# EAGLE schematic 32a4u (EAGLE 6.1)
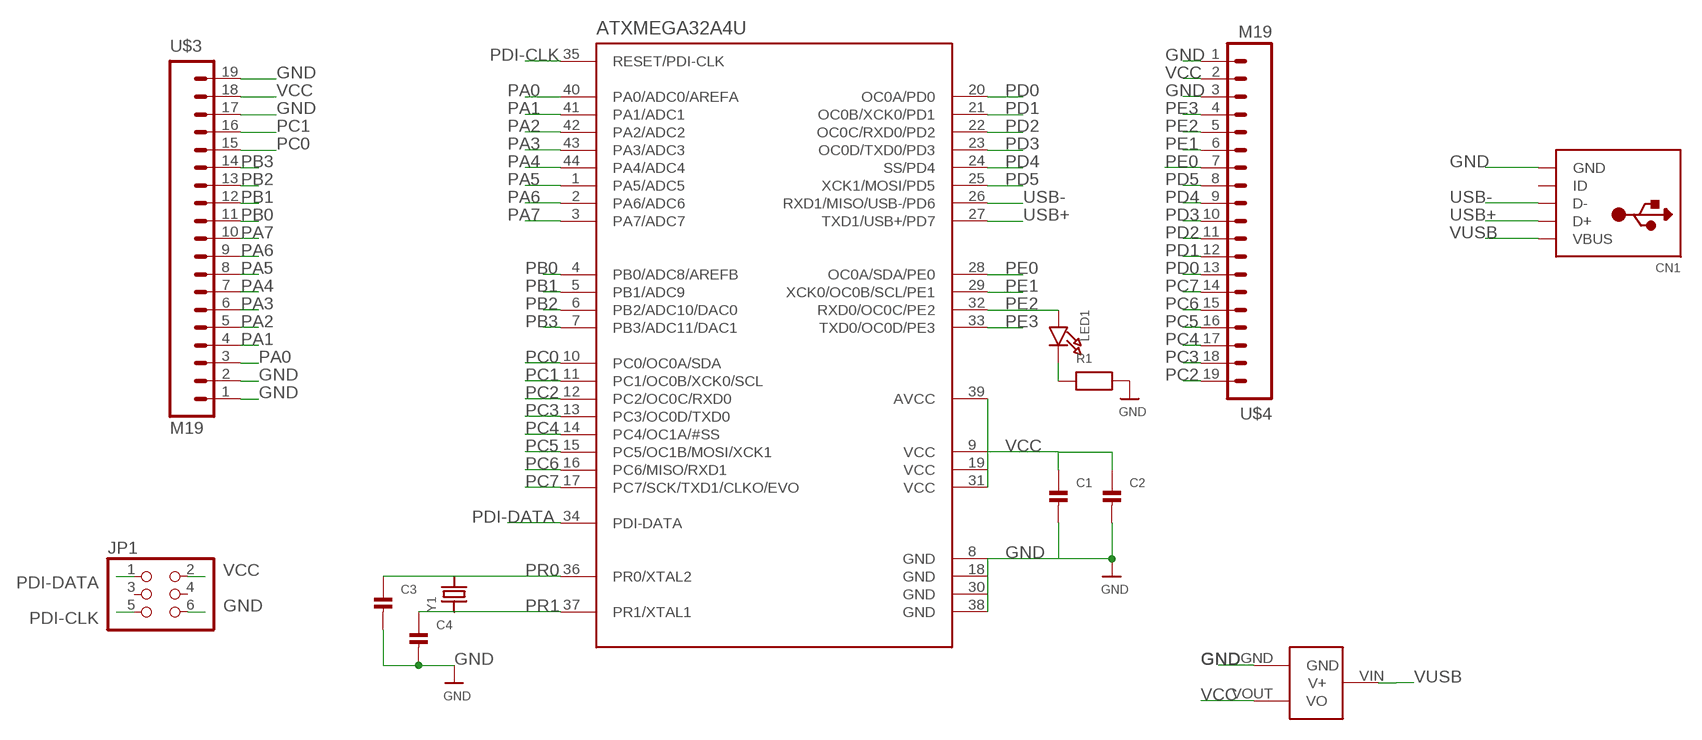
[diagram p0: schematic, sheet 1]

## Parts
ATXMEGA32A4U  ATXMEGAXXA4U-AU  [TQFP-44]
C1  CAP_CERAMIC0603  [0603]
C2  CAP_CERAMIC0603  [0603]
C3  CAP_CERAMIC0603  [0603]
C4  CAP_CERAMIC0603  [0603]
CN1  USBMICROB  [USB-MICROB]
JP1  HEADER-2X3  [2X03]
LED1  LED0603  [CHIPLED_0603]
R1  RESISTOR0603  [0603]
U$2  MCP1700  [SOT23-3]
U$3  M19  [1X19]
U$4  M19  [1X19]
Y1  CRYSTAL  [NX8045GB]

## Nets
GND: ATXMEGA32A4U.8(GND) ATXMEGA32A4U.18(GND) ATXMEGA32A4U.30(GND) ATXMEGA32A4U.38(GND) C1.2 C2.2 C3.2 C4.2 CN1.P5(GND) JP1.6 R1.2 U$2.GND U$3.1 U$3.2 U$3.17 U$3.19 U$4.1 U$4.3
N$1: LED1.C R1.1
PA0: ATXMEGA32A4U.40(PA0/ADC0/AREFA) U$3.3
PA1: ATXMEGA32A4U.41(PA1/ADC1) U$3.4
PA2: ATXMEGA32A4U.42(PA2/ADC2) U$3.5
PA3: ATXMEGA32A4U.43(PA3/ADC3) U$3.6
PA4: ATXMEGA32A4U.44(PA4/ADC4) U$3.7
PA5: ATXMEGA32A4U.1(PA5/ADC5) U$3.8
PA6: ATXMEGA32A4U.2(PA6/ADC6) U$3.9
PA7: ATXMEGA32A4U.3(PA7/ADC7) U$3.10
PB0: ATXMEGA32A4U.4(PB0/ADC8/AREFB) U$3.11
PB1: ATXMEGA32A4U.5(PB1/ADC9) U$3.12
PB2: ATXMEGA32A4U.6(PB2/ADC10/DAC0) U$3.13
PB3: ATXMEGA32A4U.7(PB3/ADC11/DAC1) U$3.14
PC0: ATXMEGA32A4U.10(PC0/OC0A/SDA) U$3.15
PC1: ATXMEGA32A4U.11(PC1/OC0B/XCK0/SCL) U$3.16
PC2: ATXMEGA32A4U.12(PC2/OC0C/RXD0) U$4.19
PC3: ATXMEGA32A4U.13(PC3/OC0D/TXD0) U$4.18
PC4: ATXMEGA32A4U.14(PC4/OC1A/#SS) U$4.17
PC5: ATXMEGA32A4U.15(PC5/OC1B/MOSI/XCK1) U$4.16
PC6: ATXMEGA32A4U.16(PC6/MISO/RXD1) U$4.15
PC7: ATXMEGA32A4U.17(PC7/SCK/TXD1/CLKO/EVO) U$4.14
PD0: ATXMEGA32A4U.20(OC0A/PD0) U$4.13
PD1: ATXMEGA32A4U.21(OC0B/XCK0/PD1) U$4.12
PD2: ATXMEGA32A4U.22(OC0C/RXD0/PD2) U$4.11
PD3: ATXMEGA32A4U.23(OC0D/TXD0/PD3) U$4.10
PD4: ATXMEGA32A4U.24(SS/PD4) U$4.9
PD5: ATXMEGA32A4U.25(XCK1/MOSI/PD5) U$4.8
PDI-CLK: ATXMEGA32A4U.35(RESET/PDI-CLK) JP1.5
PDI-DATA: ATXMEGA32A4U.34(PDI-DATA) JP1.1
PE0: ATXMEGA32A4U.28(OC0A/SDA/PE0) U$4.7
PE1: ATXMEGA32A4U.29(XCK0/OC0B/SCL/PE1) U$4.6
PE2: ATXMEGA32A4U.32(RXD0/OC0C/PE2) LED1.A U$4.5
PE3: ATXMEGA32A4U.33(TXD0/OC0D/PE3) U$4.4
PR0: ATXMEGA32A4U.36(PR0/XTAL2) C3.1 Y1.P$2
PR1: ATXMEGA32A4U.37(PR1/XTAL1) C4.1 Y1.P$1
USB+: ATXMEGA32A4U.27(TXD1/USB+/PD7) CN1.P3(D+)
USB-: ATXMEGA32A4U.26(RXD1/MISO/USB-/PD6) CN1.P2(D-)
VCC: ATXMEGA32A4U.9(VCC) ATXMEGA32A4U.19(VCC) ATXMEGA32A4U.31(VCC) ATXMEGA32A4U.39(AVCC) C1.1 C2.1 JP1.2 U$2.VOUT(VO) U$3.18 U$4.2
VUSB: CN1.P1(VBUS) U$2.VIN(V+)
Unconnected: CN1.P4(ID) JP1.3 JP1.4

## Library data of the parts
ATXMEGA32A4U = nonolith:ATXMEGAXXA4U: ATXMEGA A4U Series (XMEGA+USB)
C1-C4 = nonolith:CAP_CERAMIC: Ceramic Capacitors 0402 - 0402 Surface Mount Capacitors 0.1uF 10V 10% [Digikey: 490-1318-2-ND] 0603 - 0603 Surface Mount Capacitors 16 pF 50V 5% [Digikey: 445-5051-2-ND] 22 pF 50V [Digikey: PCC220ACVTR-ND] 33 pF 50V 5% [Digikey: 490-1415-1-ND] 56pF 50V 5% [Digikey: 490-1421-1-ND] 220pF 50V 5% [Digikey: 445-1285-1-ND] 680 pF 50V 2200 pF 50V 5% C0G [Digikey: 445-1297-1-ND] 5600 pF 100V 5% X7R [Digikey: 478-3711-1-ND] 0.1 µF 25V 10% [Digikey: PCC2277TR-ND] 0.22 µF 16V 10% X7R [Digikey: 445-1318-1-ND] 1.0 µF 25V 10% [Digikey: 445-5146-2-ND] 0603 - RF Specific 3pF 250V +/-0.1pF RF [Digikey: 712-1347-1-ND] 18 pF 250V 5% [Digikey: 478-3505-1-ND or 712-1322-1-ND] 56 pF 250V 5% C0G RF [Digikey: 490-4867-1-ND] 68 pF 250V RF [Digikey: 490-4868-1-ND] 0805 - 0805 Surface Mount Capacitors 220 pF 250V 2% RF Ceramic Capacitor [Digikey: 712-1398-1-ND] 1000 pF 50V 2% NP0 Ceramic Capacitor [Digikey: 478-3760-1-ND] 0.1 µF 25V 10% Ceramic Capacitor [Digikey: PCC1828TR-ND] 1.0 µF 16V 10% Ceramic Capacitor[Digikey: 490-1691-2-ND] 10.0 µF 10V 10% Ceramic Capacitor[Digikey: 709-1228-1-ND] 1206 - 1206 Surface Mount Capacitors
CN1 = nonolith:USB: USB Connectors USBMINIB - Surface Mount Female Mini-B USB Connector 4UConnector: 06564 By microbuilder.eu
JP1 = nonolith:HEADER-2X3: PIN HEADER
LED1 = microbuilder:LED: LED 0603 - 0603 Surface Mount Package 2mA: Green LED - Low Power (3.9mcd, 2ma, 1.7Vf) - Digikey: 475-2709-2-ND Orange LED - Low Power (9.8mcd, 2ma, 1.8Vf) - Digikey: 475-1194-2-ND Red LED - Low Power (5mcd, 2ma, 1.8Vf) - Digikey: 475-1195-2-ND Yellow LED - Low Power (7mcd, 2ma, 1.8Vf) - Digikey: 475-1196-2-ND 5mA: Blue LED - Low Power (17mcd, 5ma, 2.9Vf) - Digikey: LNJ937W8CRACT-ND 0805 - 0805 Surface Mount Package 2mA: Red LED (8.8mcd, 2mA, 1.8Vf, Clear) - Low Power [Digikey: 475-2510-1-ND] Green LED (5mcd, 2mA, 1.8Vf, Clear) - Low Power [Digikey: 475-2730-1-ND] Yellow LED (11.3mcd, 2mA, 1.8Vf, Clear) - Low Power [Digikey: 475-2555-1-ND] 20mA: Red LED (104mcd, 20mA, Diffused) - LS R976 [Digikey: 475-1278-6-ND] Red LED (12mcd, 20mA, 2.0Vf, Clear) - APT2012EC [Digikey: 754-1128-1-ND] Green LED (15mcd, 20mA, 2.2Vf, Clear) - APT2012GC [Digikey: 754-1131-1-ND] Orange LED (160mcd, 20mA, 2.1Vf, Clear) - APT2012SECK [Digikey: 754-1130-1-ND] 1206 - 1206 Surface Mount Package Green LED (26mcd, 20mA, Diffused) - LG N971 [Digikey: 475-1407-6-ND] Red LED (15mcd, 20mA, Diffused) - LH N974 [Digikey: 475-1416-6-ND]
R1 = nonolith:RESISTOR: Resistors 0402 - 0402 Surface Mount Package 10.0K 1% 1/16W [Digikey: 311-10.0KLRTR-ND] 0603 - 0603 Surface Mount Package 0 Ohm 1/10 Watt 1% Resistor 15 Ohm 1/10 Watt 1% Resistor 33 Ohm 1/10 Watt 1% Resistor 49.9 Ohm 1/10 Watt 1% Resistor 100 Ohm 1/10 Watt 1% Resistor 150 Ohm 1/10 Watt 1% Resistor 240 Ohm 1/10 Watt 1% Resistor 390 Ohm 1/10 Watt 1% Resistor 560 Ohm 1/10 Watt 1% Resistor 750 Ohm 1/10 Watt 1% Resistor 1.0K Ohm 1/10 Watt 1% Resistor 1.5K Ohm 1/10 Watt 1% Resistor 2.0K Ohm 1/10 Watt 1% Resistor 4.7K Ohm 1/10 Watt 1% Resistor 10.0K Ohm 1/10 Watt 1% Resistor 20.0K Ohm 1/10 Watt 1% Resistor 33.0K Ohm 1/10 Watt 1% Resistor 100.0K Ohm 1/10 Watt 1% Resistor 0805 - 0805 Surface Mount Package 0 Ohm 1/8 Watt 1% Resistor 33 Ohm 1/8 Watt 1% Resistor 100 Ohm 1/8 Watt 1% Resistor 150 Ohm 1/8 Watt 1% Resistor 200 Ohm 1/8 Watt 1% Resistor 240 Ohm 1/8 Watt 1% Resistor 330 Ohm 1/8 Watt 1% Resistor 390 Ohm 1/8 Watt 1% Resistor 470 Ohm 1/8 Watt 1% Resistor 1.0K Ohm 1/8 Watt 1% Resistor 1.5K Ohm 1/8 Watt 1% Resistor 2.0K Ohm 1/8 Watt 1% Resistor 4.7K Ohm 1/8 Watt 1% Resistor 5.1K Ohm 1/8 Watt 1% Resistor 5.6K Ohm 1/8 Watt 1% Resistor 10.0K Ohm 1/8 Watt 1% Resistor 22.0K Ohm 1/8 Watt 1% Resistor 33.0K Ohm 1/8 Watt 1% Resistor 100K Ohm 1/8 Watt 1% Resistor 1206 - 1206 Surface Mount Package
U$2 = nonolith:MCP1700: Voltage regulator
U$3 U$4 = SparkFun:M19
Y1 = nonolith:CRYSTAL: Crystals HC49UP - Surface Mount Crystal 4.0MHz 18pF +/-30ppm Surface Mount Crystal [Digikey: 535-9857-1-ND] 12.0 MHz Surface Mount Crystal [Digikey: 535-9869-6-ND] 25.0 MHz Surface Mount Crystal [Digikey: 535-9078-1-ND] 3.2 x 2.5mm - MEMs SMT Crystal 12.0 MHz 8pF 15ppm 3.2 x 2.5mm Crystal [Digikey: 644-1047-1-ND] 16.0 MHz 8pF 15ppm 3.2 x 2.5mm Crystal [Digikey: 644-1049-1-ND] 16.0 MHz 10pF 10ppm 3.2 x 2.5mm Crystal [Digikey: 644-1100-1-ND] 27.12 MHz 18pF 30ppm 3.2 x 2.5mm Crystal [Digikey: 887-1424-1-ND] 4.9 x 1.8mm - MEMs SMT Crystal 32.768 KHz 12.5pF 20ppm 4.9 x 1.8mm Crystal [Digikey: SE2415CT-ND] Cylinder 32.768KHz Cylinder Crystal

## Net classes
0 default: width 0.203 mm, clearance 0.152 mm